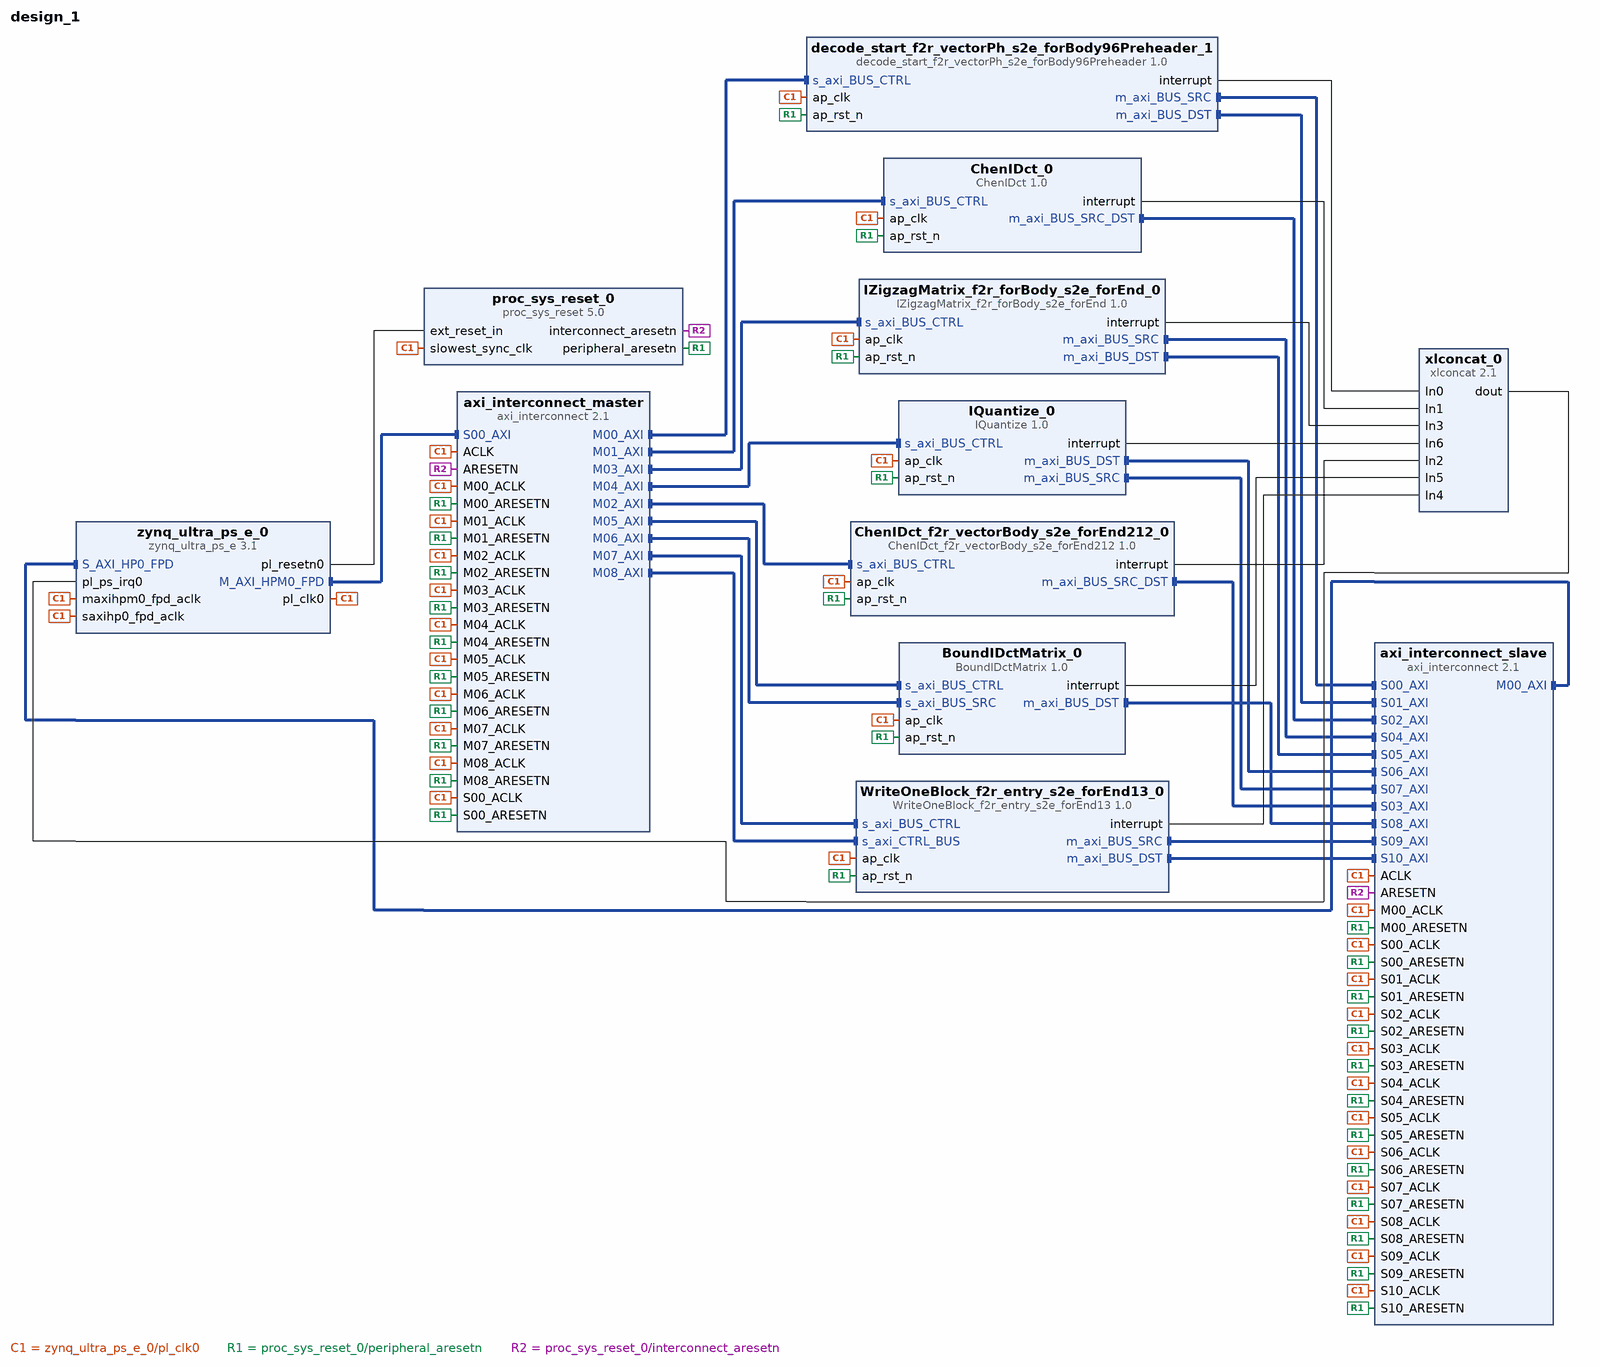
[diagram p0: block diagram of the top level]
# Vivado block design design_1, xczu9eg-ffvb1156-2-e, Vivado 2017.4
create_bd_design design_1

create_bd_cell -type ip -vlnv xilinx.com:ip:zynq_ultra_ps_e:3.1 zynq_ultra_ps_e_0
set_property -dict [list \
  CONFIG.PSU__PSS_REF_CLK__FREQMHZ 33.330 \
  CONFIG.PSU__CAN1__PERIPHERAL__ENABLE 1 \
  CONFIG.PSU__CAN1__PERIPHERAL__IO {MIO 24 .. 25} \
  CONFIG.PSU__DPAUX__PERIPHERAL__ENABLE 1 \
  CONFIG.PSU__DPAUX__PERIPHERAL__IO {MIO 27 .. 30} \
  CONFIG.PSU__GEM__TSU__ENABLE 0 \
  CONFIG.PSU__FPGA_PL0_ENABLE 1 \
  CONFIG.PSU__ENET3__PERIPHERAL__ENABLE 1 \
  CONFIG.PSU__ENET3__FIFO__ENABLE 0 \
  CONFIG.PSU__ENET3__PTP__ENABLE 0 \
  CONFIG.PSU__ENET3__PERIPHERAL__IO {MIO 64 .. 75} \
  CONFIG.PSU__ENET3__GRP_MDIO__ENABLE 1 \
  CONFIG.PSU__ENET3__GRP_MDIO__IO {MIO 76 .. 77} \
  CONFIG.PSU__GPIO0_MIO__PERIPHERAL__ENABLE 1 \
  CONFIG.PSU__GPIO0_MIO__IO {MIO 0 .. 25} \
  CONFIG.PSU__GPIO1_MIO__PERIPHERAL__ENABLE 1 \
  CONFIG.PSU__GPIO1_MIO__IO {MIO 26 .. 51} \
  CONFIG.PSU__I2C0__PERIPHERAL__ENABLE 1 \
  CONFIG.PSU__I2C0__PERIPHERAL__IO {MIO 14 .. 15} \
  CONFIG.PSU__I2C1__PERIPHERAL__ENABLE 1 \
  CONFIG.PSU__I2C1__PERIPHERAL__IO {MIO 16 .. 17} \
  CONFIG.PSU__PCIE__PERIPHERAL__ENABLE 1 \
  CONFIG.PSU__PCIE__PERIPHERAL__ENDPOINT_ENABLE 0 \
  CONFIG.PSU__PCIE__PERIPHERAL__ROOTPORT_ENABLE 1 \
  CONFIG.PSU__PCIE__PERIPHERAL__ROOTPORT_IO {MIO 31} \
  CONFIG.PSU__PCIE__LANE0__ENABLE 1 \
  CONFIG.PSU__PCIE__LANE0__IO {GT Lane0} \
  CONFIG.PSU__GT__LINK_SPEED HBR \
  CONFIG.PSU__GT__VLT_SWNG_LVL_4 0 \
  CONFIG.PSU__GT__PRE_EMPH_LVL_4 0 \
  CONFIG.PSU__USB0__REF_CLK_SEL {Ref Clk2} \
  CONFIG.PSU__USB0__REF_CLK_FREQ 26 \
  CONFIG.PSU__DP__REF_CLK_SEL {Ref Clk3} \
  CONFIG.PSU__DP__REF_CLK_FREQ 27 \
  CONFIG.PSU__SATA__REF_CLK_SEL {Ref Clk1} \
  CONFIG.PSU__SATA__REF_CLK_FREQ 125 \
  CONFIG.PSU__PCIE__REF_CLK_SEL {Ref Clk0} \
  CONFIG.PSU__PCIE__REF_CLK_FREQ 100 \
  CONFIG.PSU__DP__LANE_SEL {Single Lower} \
  CONFIG.PSU__PCIE__DEVICE_PORT_TYPE {Root Port} \
  CONFIG.PSU__PCIE__MAXIMUM_LINK_WIDTH x1 \
  CONFIG.PSU__PCIE__LINK_SPEED {5.0 Gb/s} \
  CONFIG.PSU__PCIE__BAR0_VAL 0x0 \
  CONFIG.PSU__PCIE__BAR1_VAL 0x0 \
  CONFIG.PSU__PCIE__BAR2_VAL 0x0 \
  CONFIG.PSU__PCIE__BAR3_VAL 0x0 \
  CONFIG.PSU__PCIE__BAR4_VAL 0x0 \
  CONFIG.PSU__PCIE__BAR5_VAL 0x0 \
  CONFIG.PSU__PCIE__EROM_VAL 0x0 \
  CONFIG.PSU__PCIE__MAX_PAYLOAD_SIZE {256 bytes} \
  CONFIG.PSU__PCIE__VENDOR_ID 0x10EE \
  CONFIG.PSU__PCIE__DEVICE_ID 0xD021 \
  CONFIG.PSU__PCIE__REVISION_ID 0x0 \
  CONFIG.PSU__PCIE__SUBSYSTEM_VENDOR_ID 0x10EE \
  CONFIG.PSU__PCIE__SUBSYSTEM_ID 0x7 \
  CONFIG.PSU__PCIE__CLASS_CODE_BASE 0x06 \
  CONFIG.PSU__PCIE__CLASS_CODE_SUB 0x4 \
  CONFIG.PSU__PCIE__CLASS_CODE_INTERFACE 0x0 \
  CONFIG.PSU__PCIE__CLASS_CODE_VALUE 0x60400 \
  CONFIG.PSU__PCIE__CRS_SW_VISIBILITY 1 \
  CONFIG.PSU__PMU__AIBACK__ENABLE 0 \
  CONFIG.PSU__PMU__PLERROR__ENABLE 0 \
  CONFIG.PSU__PMU__PERIPHERAL__ENABLE 1 \
  CONFIG.PSU__PMU__EMIO_GPI__ENABLE 0 \
  CONFIG.PSU__PMU__EMIO_GPO__ENABLE 0 \
  CONFIG.PSU__PMU__GPI0__ENABLE 0 \
  CONFIG.PSU__PMU__GPI1__ENABLE 0 \
  CONFIG.PSU__PMU__GPI2__ENABLE 0 \
  CONFIG.PSU__PMU__GPI3__ENABLE 0 \
  CONFIG.PSU__PMU__GPI4__ENABLE 0 \
  CONFIG.PSU__PMU__GPI5__ENABLE 0 \
  CONFIG.PSU__PMU__GPO0__ENABLE 0 \
  CONFIG.PSU__PMU__GPO1__ENABLE 0 \
  CONFIG.PSU__PMU__GPO2__ENABLE 0 \
  CONFIG.PSU__PMU__GPO3__ENABLE 0 \
  CONFIG.PSU__PMU__GPO4__ENABLE 0 \
  CONFIG.PSU__PMU__GPO5__ENABLE 0 \
  CONFIG.PSU__QSPI__PERIPHERAL__ENABLE 1 \
  CONFIG.PSU__QSPI__PERIPHERAL__IO {MIO 0 .. 12} \
  CONFIG.PSU__QSPI__PERIPHERAL__MODE {Dual Parallel} \
  CONFIG.PSU__QSPI__PERIPHERAL__DATA_MODE x4 \
  CONFIG.PSU__QSPI__GRP_FBCLK__ENABLE 1 \
  CONFIG.PSU__QSPI__GRP_FBCLK__IO {MIO 6} \
  CONFIG.PSU__SD1__PERIPHERAL__ENABLE 1 \
  CONFIG.PSU__SD1__PERIPHERAL__IO {MIO 39 .. 51} \
  CONFIG.PSU__SD1__GRP_CD__ENABLE 1 \
  CONFIG.PSU__SD1__GRP_CD__IO {MIO 45} \
  CONFIG.PSU__SD1__GRP_POW__ENABLE 0 \
  CONFIG.PSU__SD1__GRP_WP__ENABLE 1 \
  CONFIG.PSU__SD1__GRP_WP__IO {MIO 44} \
  CONFIG.PSU__SD1__SLOT_TYPE {SD 3.0} \
  CONFIG.PSU__SD1__DATA_TRANSFER_MODE 8Bit \
  CONFIG.PSU__SWDT0__PERIPHERAL__ENABLE 1 \
  CONFIG.PSU__SWDT0__CLOCK__ENABLE 0 \
  CONFIG.PSU__SWDT0__RESET__ENABLE 0 \
  CONFIG.PSU__SWDT1__PERIPHERAL__ENABLE 1 \
  CONFIG.PSU__SWDT1__CLOCK__ENABLE 0 \
  CONFIG.PSU__SWDT1__RESET__ENABLE 0 \
  CONFIG.PSU__UART0__BAUD_RATE 115200 \
  CONFIG.PSU__TTC0__PERIPHERAL__ENABLE 1 \
  CONFIG.PSU__TTC0__CLOCK__ENABLE 0 \
  CONFIG.PSU__TTC0__WAVEOUT__ENABLE 0 \
  CONFIG.PSU__TTC1__PERIPHERAL__ENABLE 1 \
  CONFIG.PSU__UART1__BAUD_RATE 115200 \
  CONFIG.PSU__TTC1__CLOCK__ENABLE 0 \
  CONFIG.PSU__TTC1__WAVEOUT__ENABLE 0 \
  CONFIG.PSU__TTC2__PERIPHERAL__ENABLE 1 \
  CONFIG.PSU__TTC2__CLOCK__ENABLE 0 \
  CONFIG.PSU__TTC2__WAVEOUT__ENABLE 0 \
  CONFIG.PSU__TTC3__PERIPHERAL__ENABLE 1 \
  CONFIG.PSU__TTC3__CLOCK__ENABLE 0 \
  CONFIG.PSU__TTC3__WAVEOUT__ENABLE 0 \
  CONFIG.PSU__CSUPMU__PERIPHERAL__VALID 1 \
  CONFIG.PSU__DDRC__BUS_WIDTH {64 Bit} \
  CONFIG.PSU__DDRC__DEVICE_CAPACITY {4096 MBits} \
  CONFIG.PSU__DDRC__DRAM_WIDTH {8 Bits} \
  CONFIG.PSU__DDRC__ECC Disabled \
  CONFIG.PSU__DDRC__MEMORY_TYPE {DDR 4} \
  CONFIG.PSU__DDRC__SPEED_BIN DDR4_2133P \
  CONFIG.PSU__DDRC__COMPONENTS UDIMM \
  CONFIG.PSU__UART0__PERIPHERAL__ENABLE 1 \
  CONFIG.PSU__UART0__PERIPHERAL__IO {MIO 18 .. 19} \
  CONFIG.PSU__UART0__MODEM__ENABLE 0 \
  CONFIG.PSU__UART1__PERIPHERAL__ENABLE 1 \
  CONFIG.PSU__UART1__PERIPHERAL__IO {MIO 20 .. 21} \
  CONFIG.PSU__UART1__MODEM__ENABLE 0 \
  CONFIG.PSU__USB0__PERIPHERAL__ENABLE 1 \
  CONFIG.PSU__USB0__PERIPHERAL__IO {MIO 52 .. 63} \
  CONFIG.PSU__USB3_0__PERIPHERAL__ENABLE 1 \
  CONFIG.PSU__USB3_0__PERIPHERAL__IO {GT Lane2} \
  CONFIG.PSU__USB3_0__EMIO__ENABLE 0 \
  CONFIG.PSU__USB2_0__EMIO__ENABLE 0 \
  CONFIG.PSU__USE__M_AXI_GP0 1 \
  CONFIG.PSU__MAXIGP0__DATA_WIDTH 128 \
  CONFIG.PSU__USE__M_AXI_GP1 0 \
  CONFIG.PSU__USE__M_AXI_GP2 0 \
  CONFIG.PSU__USE__S_AXI_GP2 1 \
  CONFIG.PSU__USE__IRQ0 1 \
  CONFIG.PSU__PRESET_APPLIED 1 \
  CONFIG.PSU__DDR_HIGH_ADDRESS_GUI_ENABLE 1 \
  CONFIG.PSU_BANK_0_IO_STANDARD LVCMOS18 \
  CONFIG.PSU_BANK_1_IO_STANDARD LVCMOS18 \
  CONFIG.PSU_BANK_2_IO_STANDARD LVCMOS18 \
  CONFIG.PSU__DISPLAYPORT__PERIPHERAL__ENABLE 1 \
  CONFIG.PSU__DISPLAYPORT__LANE0__ENABLE 1 \
  CONFIG.PSU__DISPLAYPORT__LANE0__IO {GT Lane1} \
  CONFIG.PSU__DISPLAYPORT__LANE1__ENABLE 0 \
  CONFIG.PSU__SATA__PERIPHERAL__ENABLE 1 \
  CONFIG.PSU__SATA__LANE1__IO {GT Lane3} \
  CONFIG.PSU__CRL_APB__USB3__ENABLE 1 \
  CONFIG.PSU__CRF_APB__APLL_CTRL__SRCSEL PSS_REF_CLK \
  CONFIG.PSU__CRF_APB__DPLL_CTRL__SRCSEL PSS_REF_CLK \
  CONFIG.PSU__CRF_APB__VPLL_CTRL__SRCSEL PSS_REF_CLK \
  CONFIG.PSU__CRF_APB__ACPU_CTRL__SRCSEL APLL \
  CONFIG.PSU__CRF_APB__DBG_TRACE_CTRL__SRCSEL IOPLL \
  CONFIG.PSU__CRF_APB__DBG_FPD_CTRL__SRCSEL IOPLL \
  CONFIG.PSU__CRF_APB__DP_VIDEO_REF_CTRL__SRCSEL VPLL \
  CONFIG.PSU__CRF_APB__DP_AUDIO_REF_CTRL__SRCSEL RPLL \
  CONFIG.PSU__CRF_APB__DP_STC_REF_CTRL__SRCSEL RPLL \
  CONFIG.PSU__CRF_APB__DDR_CTRL__SRCSEL DPLL \
  CONFIG.PSU__CRF_APB__GPU_REF_CTRL__SRCSEL IOPLL \
  CONFIG.PSU__CRL_APB__PL0_REF_CTRL__SRCSEL IOPLL \
  CONFIG.PSU__CRF_APB__GDMA_REF_CTRL__SRCSEL APLL \
  CONFIG.PSU__CRF_APB__DPDMA_REF_CTRL__SRCSEL APLL \
  CONFIG.PSU__CRF_APB__TOPSW_MAIN_CTRL__SRCSEL DPLL \
  CONFIG.PSU__CRF_APB__TOPSW_LSBUS_CTRL__SRCSEL IOPLL \
  CONFIG.PSU__CRF_APB__DBG_TSTMP_CTRL__SRCSEL IOPLL \
  CONFIG.PSU__CRL_APB__IOPLL_CTRL__SRCSEL PSS_REF_CLK \
  CONFIG.PSU__CRL_APB__RPLL_CTRL__SRCSEL PSS_REF_CLK \
  CONFIG.PSU__CRL_APB__GEM3_REF_CTRL__SRCSEL IOPLL \
  CONFIG.PSU__CRL_APB__USB0_BUS_REF_CTRL__SRCSEL IOPLL \
  CONFIG.PSU__CRL_APB__QSPI_REF_CTRL__SRCSEL IOPLL \
  CONFIG.PSU__CRL_APB__SDIO1_REF_CTRL__SRCSEL IOPLL \
  CONFIG.PSU__CRL_APB__UART0_REF_CTRL__SRCSEL IOPLL \
  CONFIG.PSU__CRL_APB__UART1_REF_CTRL__SRCSEL IOPLL \
  CONFIG.PSU__CRL_APB__I2C0_REF_CTRL__SRCSEL IOPLL \
  CONFIG.PSU__CRL_APB__I2C1_REF_CTRL__SRCSEL IOPLL \
  CONFIG.PSU__CRL_APB__CAN1_REF_CTRL__SRCSEL IOPLL \
  CONFIG.PSU__CRL_APB__CPU_R5_CTRL__SRCSEL IOPLL \
  CONFIG.PSU__CRL_APB__IOU_SWITCH_CTRL__SRCSEL IOPLL \
  CONFIG.PSU__CRL_APB__PCAP_CTRL__SRCSEL IOPLL \
  CONFIG.PSU__CRL_APB__LPD_LSBUS_CTRL__SRCSEL IOPLL \
  CONFIG.PSU__CRL_APB__LPD_SWITCH_CTRL__SRCSEL IOPLL \
  CONFIG.PSU__CRL_APB__DBG_LPD_CTRL__SRCSEL IOPLL \
  CONFIG.PSU__CRL_APB__ADMA_REF_CTRL__SRCSEL IOPLL \
  CONFIG.PSU__CRL_APB__TIMESTAMP_REF_CTRL__SRCSEL IOPLL \
  CONFIG.PSU__CRL_APB__USB3_DUAL_REF_CTRL__SRCSEL IOPLL \
  CONFIG.PSU__IOU_SLCR__IOU_TTC_APB_CLK__TTC0_SEL APB \
  CONFIG.PSU__IOU_SLCR__IOU_TTC_APB_CLK__TTC1_SEL APB \
  CONFIG.PSU__IOU_SLCR__IOU_TTC_APB_CLK__TTC2_SEL APB \
  CONFIG.PSU__IOU_SLCR__IOU_TTC_APB_CLK__TTC3_SEL APB \
  CONFIG.PSU__OVERRIDE__BASIC_CLOCK 0 \
  CONFIG.PSU__DLL__ISUSED 1 \
  CONFIG.PSU__DDR__INTERFACE__FREQMHZ 533.500 \
  CONFIG.PSU__CRF_APB__ACPU_CTRL__FREQMHZ 1200 \
  CONFIG.PSU__CRF_APB__DBG_TRACE_CTRL__FREQMHZ 250 \
  CONFIG.PSU__CRF_APB__DBG_FPD_CTRL__FREQMHZ 250 \
  CONFIG.PSU__CRF_APB__DDR_CTRL__FREQMHZ 1067 \
  CONFIG.PSU__CRF_APB__GPU_REF_CTRL__FREQMHZ 500 \
  CONFIG.PSU__CRL_APB__PL0_REF_CTRL__FREQMHZ 100 \
  CONFIG.PSU__CRF_APB__GDMA_REF_CTRL__FREQMHZ 600 \
  CONFIG.PSU__CRF_APB__DPDMA_REF_CTRL__FREQMHZ 600 \
  CONFIG.PSU__CRF_APB__TOPSW_MAIN_CTRL__FREQMHZ 533.33 \
  CONFIG.PSU__CRF_APB__TOPSW_LSBUS_CTRL__FREQMHZ 100 \
  CONFIG.PSU__CRF_APB__DBG_TSTMP_CTRL__FREQMHZ 250 \
  CONFIG.PSU__CRL_APB__GEM3_REF_CTRL__FREQMHZ 125 \
  CONFIG.PSU__CRL_APB__USB0_BUS_REF_CTRL__FREQMHZ 250 \
  CONFIG.PSU__CRL_APB__QSPI_REF_CTRL__FREQMHZ 125 \
  CONFIG.PSU__CRL_APB__SDIO1_REF_CTRL__FREQMHZ 200 \
  CONFIG.PSU__CRL_APB__UART0_REF_CTRL__FREQMHZ 100 \
  CONFIG.PSU__CRL_APB__UART1_REF_CTRL__FREQMHZ 100 \
  CONFIG.PSU__CRL_APB__I2C0_REF_CTRL__FREQMHZ 100 \
  CONFIG.PSU__CRL_APB__I2C1_REF_CTRL__FREQMHZ 100 \
  CONFIG.PSU__CRL_APB__CAN1_REF_CTRL__FREQMHZ 100 \
  CONFIG.PSU__CRL_APB__CPU_R5_CTRL__FREQMHZ 500 \
  CONFIG.PSU__CRL_APB__IOU_SWITCH_CTRL__FREQMHZ 250 \
  CONFIG.PSU__CRL_APB__PCAP_CTRL__FREQMHZ 200 \
  CONFIG.PSU__CRL_APB__LPD_LSBUS_CTRL__FREQMHZ 100 \
  CONFIG.PSU__CRL_APB__LPD_SWITCH_CTRL__FREQMHZ 500 \
  CONFIG.PSU__CRL_APB__DBG_LPD_CTRL__FREQMHZ 250 \
  CONFIG.PSU__CRL_APB__ADMA_REF_CTRL__FREQMHZ 500 \
  CONFIG.PSU__CRL_APB__TIMESTAMP_REF_CTRL__FREQMHZ 100 \
  CONFIG.PSU__CRL_APB__USB3_DUAL_REF_CTRL__FREQMHZ 20 \
  CONFIG.PSU__PMU_COHERENCY 0 \
  CONFIG.PSU__USB0_COHERENCY 0 \
  CONFIG.PSU__SD1_COHERENCY 0 \
  CONFIG.PSU__QSPI_COHERENCY 0 \
  CONFIG.PSU__ENET3__TSU__ENABLE 0 \
  CONFIG.PSU__GEM3_COHERENCY 0 \
] [get_bd_cells zynq_ultra_ps_e_0]
# 101 more settings of zynq_ultra_ps_e_0 are not shown: defaults, MIO pin electricals, DDR timing, and values the tool derives
create_bd_cell -type ip -vlnv xilinx.com:ip:xlconcat:2.1 xlconcat_0
set_property -dict {CONFIG.NUM_PORTS 7} [get_bd_cells xlconcat_0]
create_bd_cell -type ip -vlnv xilinx.com:ip:proc_sys_reset:5.0 proc_sys_reset_0
create_bd_cell -type ip -vlnv xilinx.com:ip:axi_interconnect:2.1 axi_interconnect_slave
set_property -dict {CONFIG.NUM_SI 11 CONFIG.NUM_MI 1} [get_bd_cells axi_interconnect_slave]
create_bd_cell -type ip -vlnv xilinx.com:ip:axi_interconnect:2.1 axi_interconnect_master
set_property -dict {CONFIG.NUM_MI 9} [get_bd_cells axi_interconnect_master]
create_bd_cell -type ip -vlnv xilinx.com:hls:decode_start_f2r_vectorPh_s2e_forBody96Preheader:1.0 decode_start_f2r_vectorPh_s2e_forBody96Preheader_1
create_bd_cell -type ip -vlnv xilinx.com:hls:ChenIDct:1.0 ChenIDct_0
create_bd_cell -type ip -vlnv xilinx.com:hls:WriteOneBlock_f2r_entry_s2e_forEnd13:1.0 WriteOneBlock_f2r_entry_s2e_forEnd13_0
create_bd_cell -type ip -vlnv xilinx.com:hls:IZigzagMatrix_f2r_forBody_s2e_forEnd:1.0 IZigzagMatrix_f2r_forBody_s2e_forEnd_0
create_bd_cell -type ip -vlnv xilinx.com:hls:IQuantize:1.0 IQuantize_0
create_bd_cell -type ip -vlnv xilinx.com:hls:BoundIDctMatrix:1.0 BoundIDctMatrix_0
create_bd_cell -type ip -vlnv xilinx.com:hls:ChenIDct_f2r_vectorBody_s2e_forEnd212:1.0 ChenIDct_f2r_vectorBody_s2e_forEnd212_0

# ---- connections ----

connect_bd_intf_net [get_bd_intf_pins zynq_ultra_ps_e_0/M_AXI_HPM0_FPD] [get_bd_intf_pins axi_interconnect_master/S00_AXI]
connect_bd_intf_net [get_bd_intf_pins decode_start_f2r_vectorPh_s2e_forBody96Preheader_1/m_axi_BUS_SRC] [get_bd_intf_pins axi_interconnect_slave/S00_AXI]
connect_bd_intf_net [get_bd_intf_pins decode_start_f2r_vectorPh_s2e_forBody96Preheader_1/m_axi_BUS_DST] [get_bd_intf_pins axi_interconnect_slave/S01_AXI]
connect_bd_intf_net [get_bd_intf_pins decode_start_f2r_vectorPh_s2e_forBody96Preheader_1/s_axi_BUS_CTRL] [get_bd_intf_pins axi_interconnect_master/M00_AXI]
connect_bd_intf_net [get_bd_intf_pins axi_interconnect_slave/M00_AXI] [get_bd_intf_pins zynq_ultra_ps_e_0/S_AXI_HP0_FPD]
connect_bd_intf_net [get_bd_intf_pins ChenIDct_0/s_axi_BUS_CTRL] [get_bd_intf_pins axi_interconnect_master/M01_AXI]
connect_bd_intf_net [get_bd_intf_pins ChenIDct_0/m_axi_BUS_SRC_DST] [get_bd_intf_pins axi_interconnect_slave/S02_AXI]
connect_bd_intf_net [get_bd_intf_pins WriteOneBlock_f2r_entry_s2e_forEnd13_0/m_axi_BUS_SRC] [get_bd_intf_pins axi_interconnect_slave/S09_AXI]
connect_bd_intf_net [get_bd_intf_pins WriteOneBlock_f2r_entry_s2e_forEnd13_0/m_axi_BUS_DST] [get_bd_intf_pins axi_interconnect_slave/S10_AXI]
connect_bd_intf_net [get_bd_intf_pins WriteOneBlock_f2r_entry_s2e_forEnd13_0/s_axi_BUS_CTRL] [get_bd_intf_pins axi_interconnect_master/M07_AXI]
connect_bd_intf_net [get_bd_intf_pins WriteOneBlock_f2r_entry_s2e_forEnd13_0/s_axi_CTRL_BUS] [get_bd_intf_pins axi_interconnect_master/M08_AXI]
connect_bd_intf_net [get_bd_intf_pins IZigzagMatrix_f2r_forBody_s2e_forEnd_0/m_axi_BUS_SRC] [get_bd_intf_pins axi_interconnect_slave/S04_AXI]
connect_bd_intf_net [get_bd_intf_pins IZigzagMatrix_f2r_forBody_s2e_forEnd_0/m_axi_BUS_DST] [get_bd_intf_pins axi_interconnect_slave/S05_AXI]
connect_bd_intf_net [get_bd_intf_pins IZigzagMatrix_f2r_forBody_s2e_forEnd_0/s_axi_BUS_CTRL] [get_bd_intf_pins axi_interconnect_master/M03_AXI]
connect_bd_intf_net [get_bd_intf_pins IQuantize_0/m_axi_BUS_DST] [get_bd_intf_pins axi_interconnect_slave/S06_AXI]
connect_bd_intf_net [get_bd_intf_pins IQuantize_0/m_axi_BUS_SRC] [get_bd_intf_pins axi_interconnect_slave/S07_AXI]
connect_bd_intf_net [get_bd_intf_pins IQuantize_0/s_axi_BUS_CTRL] [get_bd_intf_pins axi_interconnect_master/M04_AXI]
connect_bd_intf_net [get_bd_intf_pins BoundIDctMatrix_0/s_axi_BUS_CTRL] [get_bd_intf_pins axi_interconnect_master/M05_AXI]
connect_bd_intf_net [get_bd_intf_pins BoundIDctMatrix_0/s_axi_BUS_SRC] [get_bd_intf_pins axi_interconnect_master/M06_AXI]
connect_bd_intf_net [get_bd_intf_pins BoundIDctMatrix_0/m_axi_BUS_DST] [get_bd_intf_pins axi_interconnect_slave/S08_AXI]
connect_bd_intf_net [get_bd_intf_pins ChenIDct_f2r_vectorBody_s2e_forEnd212_0/m_axi_BUS_SRC_DST] [get_bd_intf_pins axi_interconnect_slave/S03_AXI]
connect_bd_intf_net [get_bd_intf_pins ChenIDct_f2r_vectorBody_s2e_forEnd212_0/s_axi_BUS_CTRL] [get_bd_intf_pins axi_interconnect_master/M02_AXI]
connect_bd_net [get_bd_pins xlconcat_0/dout] [get_bd_pins zynq_ultra_ps_e_0/pl_ps_irq0]
connect_bd_net [get_bd_pins zynq_ultra_ps_e_0/pl_clk0] \
  [get_bd_pins zynq_ultra_ps_e_0/maxihpm0_fpd_aclk] [get_bd_pins proc_sys_reset_0/slowest_sync_clk] \
  [get_bd_pins decode_start_f2r_vectorPh_s2e_forBody96Preheader_1/ap_clk] [get_bd_pins zynq_ultra_ps_e_0/saxihp0_fpd_aclk] \
  [get_bd_pins ChenIDct_0/ap_clk] [get_bd_pins axi_interconnect_master/S00_ACLK] \
  [get_bd_pins axi_interconnect_master/M00_ACLK] [get_bd_pins axi_interconnect_master/ACLK] \
  [get_bd_pins axi_interconnect_slave/S00_ACLK] [get_bd_pins axi_interconnect_slave/M00_ACLK] \
  [get_bd_pins axi_interconnect_slave/ACLK] [get_bd_pins axi_interconnect_slave/S01_ACLK] \
  [get_bd_pins axi_interconnect_slave/S02_ACLK] [get_bd_pins axi_interconnect_master/M01_ACLK] \
  [get_bd_pins axi_interconnect_slave/S03_ACLK] [get_bd_pins axi_interconnect_slave/S04_ACLK] \
  [get_bd_pins axi_interconnect_slave/S05_ACLK] [get_bd_pins axi_interconnect_slave/S06_ACLK] \
  [get_bd_pins axi_interconnect_slave/S07_ACLK] [get_bd_pins axi_interconnect_slave/S08_ACLK] \
  [get_bd_pins axi_interconnect_slave/S09_ACLK] [get_bd_pins WriteOneBlock_f2r_entry_s2e_forEnd13_0/ap_clk] \
  [get_bd_pins axi_interconnect_slave/S10_ACLK] [get_bd_pins axi_interconnect_master/M02_ACLK] \
  [get_bd_pins axi_interconnect_master/M03_ACLK] [get_bd_pins axi_interconnect_master/M04_ACLK] \
  [get_bd_pins axi_interconnect_master/M05_ACLK] [get_bd_pins axi_interconnect_master/M06_ACLK] \
  [get_bd_pins axi_interconnect_master/M07_ACLK] [get_bd_pins axi_interconnect_master/M08_ACLK] \
  [get_bd_pins IZigzagMatrix_f2r_forBody_s2e_forEnd_0/ap_clk] [get_bd_pins IQuantize_0/ap_clk] \
  [get_bd_pins BoundIDctMatrix_0/ap_clk] [get_bd_pins ChenIDct_f2r_vectorBody_s2e_forEnd212_0/ap_clk]
connect_bd_net [get_bd_pins proc_sys_reset_0/peripheral_aresetn] \
  [get_bd_pins decode_start_f2r_vectorPh_s2e_forBody96Preheader_1/ap_rst_n] [get_bd_pins ChenIDct_0/ap_rst_n] \
  [get_bd_pins axi_interconnect_master/S00_ARESETN] [get_bd_pins axi_interconnect_master/M00_ARESETN] \
  [get_bd_pins axi_interconnect_slave/S00_ARESETN] [get_bd_pins axi_interconnect_slave/M00_ARESETN] \
  [get_bd_pins axi_interconnect_slave/S01_ARESETN] [get_bd_pins axi_interconnect_slave/S02_ARESETN] \
  [get_bd_pins axi_interconnect_master/M01_ARESETN] [get_bd_pins axi_interconnect_slave/S03_ARESETN] \
  [get_bd_pins axi_interconnect_slave/S04_ARESETN] [get_bd_pins axi_interconnect_slave/S05_ARESETN] \
  [get_bd_pins axi_interconnect_slave/S06_ARESETN] [get_bd_pins axi_interconnect_slave/S07_ARESETN] \
  [get_bd_pins axi_interconnect_slave/S08_ARESETN] [get_bd_pins axi_interconnect_slave/S09_ARESETN] \
  [get_bd_pins WriteOneBlock_f2r_entry_s2e_forEnd13_0/ap_rst_n] [get_bd_pins axi_interconnect_slave/S10_ARESETN] \
  [get_bd_pins axi_interconnect_master/M02_ARESETN] [get_bd_pins axi_interconnect_master/M03_ARESETN] \
  [get_bd_pins axi_interconnect_master/M04_ARESETN] [get_bd_pins axi_interconnect_master/M05_ARESETN] \
  [get_bd_pins axi_interconnect_master/M06_ARESETN] [get_bd_pins axi_interconnect_master/M07_ARESETN] \
  [get_bd_pins axi_interconnect_master/M08_ARESETN] [get_bd_pins IZigzagMatrix_f2r_forBody_s2e_forEnd_0/ap_rst_n] \
  [get_bd_pins IQuantize_0/ap_rst_n] [get_bd_pins BoundIDctMatrix_0/ap_rst_n] \
  [get_bd_pins ChenIDct_f2r_vectorBody_s2e_forEnd212_0/ap_rst_n]
connect_bd_net [get_bd_pins zynq_ultra_ps_e_0/pl_resetn0] [get_bd_pins proc_sys_reset_0/ext_reset_in]
connect_bd_net [get_bd_pins proc_sys_reset_0/interconnect_aresetn] \
  [get_bd_pins axi_interconnect_master/ARESETN] [get_bd_pins axi_interconnect_slave/ARESETN]
connect_bd_net [get_bd_pins decode_start_f2r_vectorPh_s2e_forBody96Preheader_1/interrupt] [get_bd_pins xlconcat_0/In0]
connect_bd_net [get_bd_pins ChenIDct_0/interrupt] [get_bd_pins xlconcat_0/In1]
connect_bd_net [get_bd_pins WriteOneBlock_f2r_entry_s2e_forEnd13_0/interrupt] [get_bd_pins xlconcat_0/In4]
connect_bd_net [get_bd_pins IZigzagMatrix_f2r_forBody_s2e_forEnd_0/interrupt] [get_bd_pins xlconcat_0/In3]
connect_bd_net [get_bd_pins IQuantize_0/interrupt] [get_bd_pins xlconcat_0/In6]
connect_bd_net [get_bd_pins BoundIDctMatrix_0/interrupt] [get_bd_pins xlconcat_0/In5]
connect_bd_net [get_bd_pins ChenIDct_f2r_vectorBody_s2e_forEnd212_0/interrupt] [get_bd_pins xlconcat_0/In2]

# ---- address map ----
assign_bd_address -offset 0x0000000000000000 -range 2G -target_address_space [get_bd_addr_spaces BoundIDctMatrix_0/Data_m_axi_BUS_DST] [get_bd_addr_segs zynq_ultra_ps_e_0/SAXIGP2/HP0_DDR_LOW]
assign_bd_address -offset 0x0000000000000000 -range 2G -target_address_space [get_bd_addr_spaces ChenIDct_0/Data_m_axi_BUS_SRC_DST] [get_bd_addr_segs zynq_ultra_ps_e_0/SAXIGP2/HP0_DDR_LOW]
assign_bd_address -offset 0x0000000000000000 -range 2G -target_address_space [get_bd_addr_spaces ChenIDct_f2r_vectorBody_s2e_forEnd212_0/Data_m_axi_BUS_SRC_DST] [get_bd_addr_segs zynq_ultra_ps_e_0/SAXIGP2/HP0_DDR_LOW]
assign_bd_address -offset 0x0000000000000000 -range 2G -target_address_space [get_bd_addr_spaces decode_start_f2r_vectorPh_s2e_forBody96Preheader_1/Data_m_axi_BUS_DST] [get_bd_addr_segs zynq_ultra_ps_e_0/SAXIGP2/HP0_DDR_LOW]
assign_bd_address -offset 0x0000000000000000 -range 2G -target_address_space [get_bd_addr_spaces decode_start_f2r_vectorPh_s2e_forBody96Preheader_1/Data_m_axi_BUS_SRC] [get_bd_addr_segs zynq_ultra_ps_e_0/SAXIGP2/HP0_DDR_LOW]
assign_bd_address -offset 0x0000000000000000 -range 2G -target_address_space [get_bd_addr_spaces IQuantize_0/Data_m_axi_BUS_DST] [get_bd_addr_segs zynq_ultra_ps_e_0/SAXIGP2/HP0_DDR_LOW]
assign_bd_address -offset 0x0000000000000000 -range 2G -target_address_space [get_bd_addr_spaces IQuantize_0/Data_m_axi_BUS_SRC] [get_bd_addr_segs zynq_ultra_ps_e_0/SAXIGP2/HP0_DDR_LOW]
assign_bd_address -offset 0x0000000000000000 -range 2G -target_address_space [get_bd_addr_spaces IZigzagMatrix_f2r_forBody_s2e_forEnd_0/Data_m_axi_BUS_DST] [get_bd_addr_segs zynq_ultra_ps_e_0/SAXIGP2/HP0_DDR_LOW]
assign_bd_address -offset 0x0000000000000000 -range 2G -target_address_space [get_bd_addr_spaces IZigzagMatrix_f2r_forBody_s2e_forEnd_0/Data_m_axi_BUS_SRC] [get_bd_addr_segs zynq_ultra_ps_e_0/SAXIGP2/HP0_DDR_LOW]
assign_bd_address -offset 0x0000000000000000 -range 2G -target_address_space [get_bd_addr_spaces WriteOneBlock_f2r_entry_s2e_forEnd13_0/Data_m_axi_BUS_DST] [get_bd_addr_segs zynq_ultra_ps_e_0/SAXIGP2/HP0_DDR_LOW]
assign_bd_address -offset 0x0000000000000000 -range 2G -target_address_space [get_bd_addr_spaces WriteOneBlock_f2r_entry_s2e_forEnd13_0/Data_m_axi_BUS_SRC] [get_bd_addr_segs zynq_ultra_ps_e_0/SAXIGP2/HP0_DDR_LOW]
assign_bd_address -offset 0x000A0000000 -range 64K -target_address_space [get_bd_addr_spaces zynq_ultra_ps_e_0/Data] [get_bd_addr_segs ChenIDct_0/s_axi_BUS_CTRL/Reg]
assign_bd_address -offset 0x000A0010000 -range 64K -target_address_space [get_bd_addr_spaces zynq_ultra_ps_e_0/Data] [get_bd_addr_segs decode_start_f2r_vectorPh_s2e_forBody96Preheader_1/s_axi_BUS_CTRL/Reg]
assign_bd_address -offset 0x000A0020000 -range 64K -target_address_space [get_bd_addr_spaces zynq_ultra_ps_e_0/Data] [get_bd_addr_segs IZigzagMatrix_f2r_forBody_s2e_forEnd_0/s_axi_BUS_CTRL/Reg]
assign_bd_address -offset 0x000A0030000 -range 64K -target_address_space [get_bd_addr_spaces zynq_ultra_ps_e_0/Data] [get_bd_addr_segs BoundIDctMatrix_0/s_axi_BUS_SRC/Reg]
assign_bd_address -offset 0x000A0040000 -range 64K -target_address_space [get_bd_addr_spaces zynq_ultra_ps_e_0/Data] [get_bd_addr_segs IQuantize_0/s_axi_BUS_CTRL/Reg]
assign_bd_address -offset 0x000A0050000 -range 64K -target_address_space [get_bd_addr_spaces zynq_ultra_ps_e_0/Data] [get_bd_addr_segs BoundIDctMatrix_0/s_axi_BUS_CTRL/Reg]
assign_bd_address -offset 0x000A0060000 -range 64K -target_address_space [get_bd_addr_spaces zynq_ultra_ps_e_0/Data] [get_bd_addr_segs ChenIDct_f2r_vectorBody_s2e_forEnd212_0/s_axi_BUS_CTRL/Reg]
assign_bd_address -offset 0x000A0070000 -range 64K -target_address_space [get_bd_addr_spaces zynq_ultra_ps_e_0/Data] [get_bd_addr_segs WriteOneBlock_f2r_entry_s2e_forEnd13_0/s_axi_BUS_CTRL/Reg]
assign_bd_address -offset 0x000A0080000 -range 64K -target_address_space [get_bd_addr_spaces zynq_ultra_ps_e_0/Data] [get_bd_addr_segs WriteOneBlock_f2r_entry_s2e_forEnd13_0/s_axi_CTRL_BUS/Reg]

validate_bd_design
save_bd_design
